# Altium project MAKKI_ISMAIL_ESPS3_CAM.PrjPcb
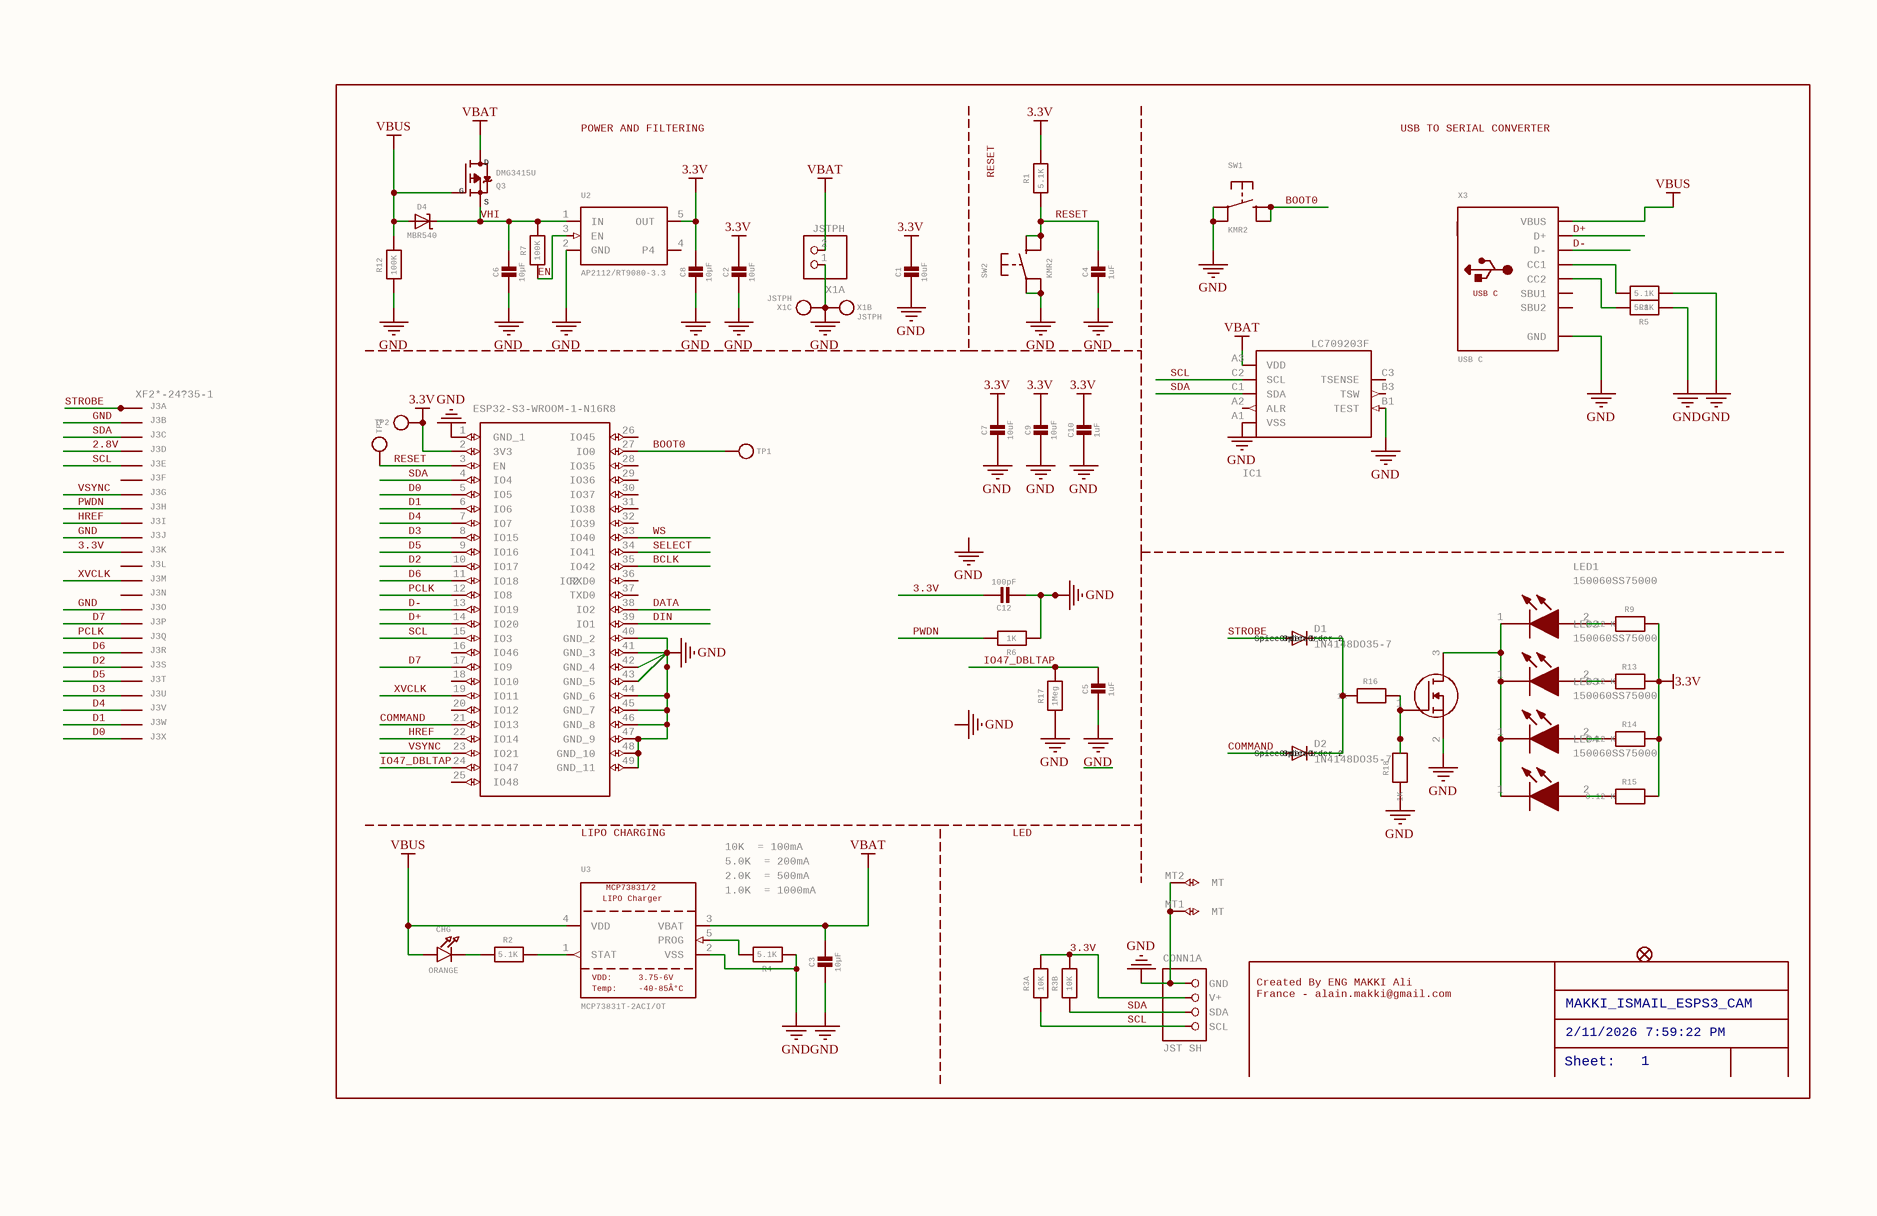
[diagram p0: MAKKI_ISMAIL_ESPS3_CAM_0.SchDoc]
2 sheets, 73 parts. Net scope: global (net labels, ports and power ports of the same name join across sheets).
Board file: MAKKI_ISMAIL_ESPS3_CAM.PcbDoc
Sheets:
  MAKKI_ISMAIL_ESPS3_CAM_0.SchDoc
  MAKKI_ISMAIL_ESPS3_CAM_1.SchDoc

## Sheet MAKKI_ISMAIL_ESPS3_CAM_0.SchDoc: MAKKI_ISMAIL_ESPS3_CAM
size 329 x 212 mm; COMPANY: ADAFRUIT INDUSTRIES; DRAWN: KTOWN; REV: B; Origin: Eagle; OriginPath: C:\Users\aliam\OneDrive\Desktop\MAKKI_ISMAIL_ESPS3_CAM - Copy\MAKKI_ISMAIL_ESPS3_CAM\MAKKI_ISMAIL_ESPS3_CAM.sch; OriginSheet: 1; Date: 2/11/2026 7:59:22 PM; SheetNumber: 1; GateName_1: G$1; SymbolName_1: A4L-LOC; LibraryName: frames; DeviceSetName: A4L-LOC; Sheet: Sheet:

### Parts
C1  10uF  [0805-NO]
C2  10uF  [0805-NO]
C3  10µF  [0805-NO]
C4  1uF  [0603-NO]
C5  1uF  [0603-NO]
C6  10µF  [0805-NO]
C7  10uF  [0805-NO]
C8  10µF  [0805-NO]
C9  10uF  [0805-NO]
C10  1uF  [0603-NO]
C12  100pF  [0805-NO]
CHG  ORANGE  [CHIPLED_0603_NOOUTLINE]
CONN1  JST SH  [JST_SH4_RA]  (parts A,B,C of 3)
D1  1N4148DO35-7  SpiceOrder1: SpiceOrder 1  SpiceOrder2: SpiceOrder 2  [DO35-7]
D2  1N4148DO35-7  SpiceOrder1: SpiceOrder 1  SpiceOrder2: SpiceOrder 2  [DO35-7]
D4  MBR540  [SOD-123]
IC1  LC709203F/MH  [WLCSP9]  (value not drawn)
IC2  ESP32-S3-WROOM-1-N16R8  [ESP32S3WROOM1N16R8]
J3  XF2*-24?35-1  [XF2L-2435-1]  (parts A,B,C,D,E,F,G,H,I,J,K,L,M,N,O,P,Q,R,S,T,U,V,W,X of 24)
LED1  150060SS75000  [LEDC1608X80N]
LED2  150060SS75000  [LEDC1608X80N]
LED3  150060SS75000  [LEDC1608X80N]
LED4  150060SS75000  [LEDC1608X80N]
Q2  2N7002  [SOT96P240X120-3N]  (value not drawn)
Q3  DMG3415U  [SOT23-R]
R1  5.1K  [0603-NO]
R2  5.1K  [0603-NO]
R3  10K  [RESPACK_4X0603]  (parts A,B of 4)
R4  5.1K  [0603-NO]
R5  5.1K  [0603-NO]
R6  1K  [0603-NO]
R7  100K  [0603-NO]
R8  5.1K  [0603-NO]
R9  0.12 K  [0603-NO]
R12  100K  [0603-NO]
R13  0.12 K  [0603-NO]
R14  0.12 K  [0603-NO]
R15  0.12 K  [0603-NO]
R16  1K  [0603-NO]
R17  1Meg  [0603-NO]
R18  1K  [0603-NO]
SW1  KMR2  [BTN_KMR2_4.6X2.8]
SW2  KMR2  [BTN_KMR2_4.6X2.8]
TP1  TESTPOINTROUND1.5MMNO  [TESTPOINT_ROUND_1.5MM_NO]  (value not drawn)
TP2  TESTPOINTROUND1.5MMNO  [TESTPOINT_ROUND_1.5MM_NO]  (value not drawn)
TP3  TESTPOINTROUND1.5MMNO  [TESTPOINT_ROUND_1.5MM_NO]  (value not drawn)
U2  AP2112/RT9080-3.3  [SOT23-5]
U3  MCP73831T-2ACI/OT  LIPOCharger: LIPO Charger  Temp: Temp:  VDD: VDD:  [SOT23-5]
U$34  FIDUCIAL_1MM  [FIDUCIAL_1MM]  (value not drawn)
X1  JSTPH  [JSTPH2_BATT]  (parts A,B,C of 3)
X3  USB C  [USB_C_CUSB31-CFM2AX-01-X]

### Nets
3.3V: C1.1 C2.1 C7.1 C8.1 C9.1 C10.1 C12.1 CONN1.2(V+) IC2.2(3V3) J3.11(MS) R1.2 R3.7 R3.8 R9.2 R13.2 R14.2 R15.2 TP2.P$1 U2.5(OUT)
GND: C1.2 C2.2 C3.2 C4.2 C5.2 C6.2 C7.2 C8.2 C9.2 C10.2 C12.2 CONN1.1(GND) CONN1.MT1(MT) CONN1.MT2(MT) IC1.A1(VSS) IC1.B1(TEST) IC2.1(GND_1) IC2.40(GND_2) IC2.41(GND_3) IC2.42(GND_4) IC2.43(GND_5) IC2.44(GND_6) IC2.45(GND_7) IC2.46(GND_8) IC2.47(GND_9) IC2.48(GND_10) IC2.49(GND_11) J3.2(MS) J3.10(MS) J3.15(MS) Q2.2(S) R4.1 R5.1 R6.1 R8.1 R12.1 R17.1 R18.1 SW1.A(P) SW1.A'(P1) SW2.A(P) SW2.A'(P1) U2.2(GND) U3.2(VSS) X1.1 X1.NC1(P$1) X1.NC2(P$1) X3.A1B12,B1A12(GND)
VBAT: C3.1 IC1.A3(VDD) Q3.3(D) U3.3(VBAT) X1.2
VBUS: CHG.A D4.A Q3.1(G) R12.2 U3.4(VDD) X3.A4B9,B4A9(VBUS)
2.8V: J3.4(MS)
BCLK: IC2.35(IO42)
BOOT0: IC2.27(IO0) SW1.B(S) SW1.B'(S1) TP1.P$1
COMMAND: D2.A IC2.21(IO13)
D0: IC2.5(IO5) J3.24(MS)
D1: IC2.6(IO6) J3.23(MS)
D2: IC2.10(IO17) J3.19(MS)
D3: IC2.8(IO15) J3.21(MS)
D4: IC2.7(IO7) J3.22(MS)
D5: IC2.9(IO16) J3.20(MS)
D6: IC2.11(IO18) J3.18(MS)
D7: IC2.17(IO9) J3.16(MS)
D+: IC2.14(IO20) X3.A6,B6(D+)
D-: IC2.13(IO19) X3.A7,B7(D-)
DATA: IC2.38(IO2)
DIN: IC2.39(IO1)
EN: R7.1 U2.3(EN)
HREF: IC2.22(IO14) J3.9(MS)
IO47_DBLTAP: C5.1 IC2.24(IO47) R17.2
PCLK: IC2.12(IO8) J3.17(MS)
PWDN: J3.8(MS) R6.2
RESET: C4.1 IC2.3(EN) R1.1 SW2.B(S) SW2.B'(S1) TP3.P$1
SCL: CONN1.4(SCL) IC1.C2(SCL) IC2.15(IO3) J3.5(MS) R3.1
SDA: CONN1.3(SDA) IC1.C1(SDA) IC2.4(IO4) J3.3(MS) R3.2
SELECT: IC2.34(IO41)
STROBE: D1.A J3.1(MSV)
VHI: C6.1 D4.C Q3.2(S) R7.2 U2.1(IN)
VSYNC: IC2.23(IO21) J3.7(MS)
WS: IC2.33(IO40)
XVCLK: IC2.19(IO11) J3.13(MS)
NetCHG_C: CHG.C R2.1
NetD1_C: D1.C D2.C R16.1
NetLED1_1: LED1.1(K) LED2.1(K) LED3.1(K) LED4.1(K) Q2.3(D)
NetLED1_2: LED1.2(A) R9.1
NetLED2_2: LED2.2(A) R13.1
NetLED3_2: LED3.2(A) R14.1
NetLED4_2: LED4.2(A) R15.1
NetQ2_1: Q2.1(G) R16.2 R18.2
NetR2_2: R2.2 U3.1(STAT)
NetR4_2: R4.2 U3.5(PROG)
NetR5_2: R5.2 X3.B5(CC2)
NetR8_2: R8.2 X3.A5(CC1)

Not connected (* = marked no-connect by the designer): IC1 A2(ALR) B3(TSW) C3(TSENSE); IC2 16(IO46) 18(IO10) 20(IO12) 25(IO48) 26(IO45) 28(IO35) 29(IO36) 30(IO37) 31(IO38) 32(IO39) 36(RXD0) 37(TXD0); J3 6(MS) 12(MS) 14(MS); U2 4(P4); X3 A8(SBU1) B8(SBU2)

### Notes on the sheet
- POWER AND FILTERING
- USB TO SERIAL CONVERTER
- (near R1) RESET
- (near IC2) LIPO CHARGING
- 10K  = 100mA
- 5.0K  = 200mA
- 2.0K  = 500mA
- LED
- 1.0K  = 1000mA
- Created By ENG MAKKI Ali
  France - alain.makki@gmail.com
- (near U$34) MAKKI_ISMAIL_ESPS3_CAM
- Sheet:
- 2/11/2026 7:59:22 PM
- 1
- Labels drawn without touching a wire or pin: GND

### Library data of the parts
C1-C3 C6-C9 C12 = CAP_CERAMIC0805-NOOUTLINE: Ceramic Capacitors   For new designs, use the packages preceded by an '_' character since they are more reliable:   The following footprints should be used on most boards: _0402 - Standard footprint for regular board layouts  _0603 - Standard footprint for regular board layouts  _0805 - Standard footprint for regular board layouts  _1206 - Standard footprint for regular board layouts       For extremely tight-pitch boards where space is at a premium, the following 'micro-pitch' footprints can be used (smaller pads, no silkscreen outline, etc.): _0402MP - Micro-pitch footprint for very dense/compact boards  _0603MP - Micro-pitch footprint for very dense/compact boards  _0805MP - Micro-pitch footprint for very dense/compact boards  _1206MP - Micro-pitch footprint for very dense/compact boards; GateName_1: G$1; SymbolName_1: CAPACITOR; DeviceName: 0805-NOOUTLINE; LibraryName: microbuilder; DeviceSetName: CAP_CERAMIC
  C8: REV: C
C4 C5 C10 = CAP_CERAMIC0603_NO: Ceramic Capacitors   For new designs, use the packages preceded by an '_' character since they are more reliable:   The following footprints should be used on most boards: _0402 - Standard footprint for regular board layouts  _0603 - Standard footprint for regular board layouts  _0805 - Standard footprint for regular board layouts  _1206 - Standard footprint for regular board layouts       For extremely tight-pitch boards where space is at a premium, the following 'micro-pitch' footprints can be used (smaller pads, no silkscreen outline, etc.): _0402MP - Micro-pitch footprint for very dense/compact boards  _0603MP - Micro-pitch footprint for very dense/compact boards  _0805MP - Micro-pitch footprint for very dense/compact boards  _1206MP - Micro-pitch footprint for very dense/compact boards; GateName_1: G$1; SymbolName_1: CAPACITOR; DeviceName: 0603_NO; LibraryName: microbuilder; DeviceSetName: CAP_CERAMIC
CHG = LED0603_NOOUTLINE: LED0603 - 0603 Surface Mount Package    2mA: Green LED - Low Power (3.9mcd, 2ma, 1.7Vf) - Digikey: 475-2709-2-ND  Orange LED - Low Power (9.8mcd, 2ma, 1.8Vf) - Digikey: 475-1194-2-ND  Red LED - Low Power (5mcd, 2ma, 1.8Vf) - Digikey: 475-1195-2-ND  Yellow LED - Low Power (7mcd, 2ma, 1.8Vf) - Digikey: 475-1196-2-ND       5mA: Blue LED - Low Power (17mcd, 5ma, 2.9Vf) - Digikey: LNJ937W8CRACT-ND    0805 - 0805 Surface Mount Package    2mA: Red LED (8.8mcd, 2mA, 1.8Vf, Clear) - Low Power [Digikey: 475-2510-1-ND]  Green LED (5mcd, 2mA, 1.8Vf, Clear) - Low Power [Digikey: 475-2730-1-ND]  Yellow LED (11.3mcd, 2mA, 1.8Vf, Clear) - Low Power [Digikey: 475-2555-1-ND]       20mA: Red LED (104mcd, 20mA, Diffused) - LS R976 [Digikey: 475-1278-6-ND]  Red LED (12mcd, 20mA, 2.0Vf, Clear) - APT2012EC [Digikey: 754-1128-1-ND]  Green LED (15mcd, 20mA, 2.2Vf, Clear) - APT2012GC [Digikey: 754-1131-1-ND]  Orange LED (160mcd, 20mA, 2.1Vf, Clear) - APT2012SECK [Digikey: 754-1130-1-ND]     1206 - 1206 Surface Mount Package  Green LED (26mcd, 20mA, Diffused) - LG N971  [Digikey: 475-1407-6-ND]  Red LED (15mcd, 20mA, Diffused) - LH N974 [Digikey: 475-1416-6-ND]     Cree - Cree High-Power Surface Mount LEDs  XPEBWT-L1-0000-00D50 - White 111lm 350mA 2.9Vf 6200K 110Â°  XTEAWT-00-0000-00000LEE3 - White 114lm 350mA 2.85Vf 5000K 115Â°     Everlight - Everlight 45-21 Series Surface Mount LEDs  45-21/QK2C-B2832AC2CB2/2T - Warm White 2000mcd 20mA 3.25Vf 3050K 120Â°  45-21/LK2C-B38452C4CB2/2T - Nuetral White 2000mcd 20mA 3.25Vf 4150K 120Â°  45-21/LK2C-B50634C6CB2/2T - Cold White 2200mcd 20mA 3.25Vf 5650K 120Â°     PLCC2 Reverse Mount LS T77K-J1L2-1-0-2-R18-Z - Red 11.25mcd 2mA 1.8Vf 630nm 120Â°  LO T77K-L1M2-24-Z - Orange 19.6mcd 2mA 1.8Vf 606nm 120Â°  LY T77K-K2M1-26-Z - Yellow 15.7mcd 2mA 1.8Vf 587nm 120Â°; GateName_1: G$1; SymbolName_1: LED; DeviceName: 0603_NOOUTLINE; LibraryName: microbuilder; DeviceSetName: LED
CONN1 = STEMMA_I2C_QTRA: GateName_1: G$1; GateName_2: G$2; SymbolName_2: MOUNTING; GateName_3: G$3; DeviceName: _QTRA; SymbolName_1: STEMMA_I2C; SymbolName_3: MOUNTING; LibraryName: microbuilder; DeviceSetName: STEMMA_I2C
D1 D2 = 1N4148DO35-7: DIODE   high speed (Philips); GateName_1: G$1; SymbolName_1: D; DeviceSetName: 1N4148; POPULARITY: 58; DeviceName: DO35-7; LibraryName: diode
D4 = DIODE-SCHOTTKYSOD-123: GateName_1: G$1; SymbolName_1: DIODE-SCHOTTKY; DeviceName: SOD-123; LibraryName: microbuilder; DeviceSetName: DIODE-SCHOTTKY
IC1 = LC709203F/MH: GateName_1: G$1; DeviceName: /MH; SymbolName_1: LC709203F; LibraryName: adafruit_sensor; DeviceSetName: LC709203F; LC709203F: LC709203F
IC2 = ESP32-S3-WROOM-1-N16R8: Multiprotocol Modules SMD Module, ESP32-S3R8, 3.3V, 8 MB Octal PSRAM Die, 16 MB Quad SPI Flash, PCB Antenna   Source:  Datasheet; MANUFACTURER_NAME: Espressif Systems; GateName_1: G$1; SymbolName_1: ESP32-S3-WROOM-1-N16R8; LibraryName: SamacSys_Parts; DeviceSetName: ESP32-S3-WROOM-1-N16R8; HEIGHT: 3.25mm; MANUFACTURER_PART_NUMBER: ESP32-S3-WROOM-1-N16R8; MOUSER_PART_NUMBER: 356-ESP32S3WRM1N16R8; MOUSER_PRICE-STOCK: https://www.mouser.co.uk/ProductDetail/Espressif-Systems/ESP32-S3-WROOM-1-N16R8?qs=Li%252BoUPsLEnvQc9gW6AMhZg%3D%3D
J3 = XF2*-24?35-1: OMRON FPC Connector   Source : http://www.omron.com/ecb/products/pdf/fpc.pdf; MPN: XF2L-2435-1A; GateName_1: -1; SymbolName_1: PV; GateName_2: -2; SymbolName_2: P; GateName_3: -3; GateName_4: -4; GateName_5: -5; GateName_6: -6; GateName_7: -7; GateName_8: -8; GateName_9: -9; GateName_10: -10; GateName_11: -11; GateName_12: -12; GateName_13: -13; GateName_14: -14; GateName_15: -15; GateName_16: -16; GateName_17: -17; GateName_18: -18; GateName_19: -19; GateName_20: -20; GateName_21: -21; GateName_22: -22; GateName_23: -23; GateName_24: -24; DeviceName: 35-1; SymbolName_3: P; SymbolName_4: P; SymbolName_5: P; SymbolName_6: P; SymbolName_7: P; SymbolName_8: P; SymbolName_9: P; SymbolName_10: P; SymbolName_11: P; SymbolName_12: P; SymbolName_13: P; SymbolName_14: P; SymbolName_15: P; SymbolName_16: P; SymbolName_17: P; SymbolName_18: P; SymbolName_19: P; SymbolName_20: P; SymbolName_21: P; SymbolName_22: P; SymbolName_23: P; SymbolName_24: P; LibraryName: con-omron; DeviceSetName: XF2*-24?; MF: MF; OC_FARNELL: unknown; OC_NEWARK: 05M2005
LED1-LED4 = 150060SS75000: WL-SMCW SMT Mono-Color Chip LED Waterclear 0603, Super Red Typ.(@20mA): 630nm, 60mcd, 1.9V, 140 AlInGaP   Source:  Datasheet; MANUFACTURER_NAME: Wurth Elektronik; GateName_1: G$1; SymbolName_1: 150060SS75000; LibraryName: SamacSys_Parts; DeviceSetName: 150060SS75000; HEIGHT: 0.8mm; MANUFACTURER_PART_NUMBER: 150060SS75000; MOUSER_PART_NUMBER: 710-150060SS75000; MOUSER_PRICE-STOCK: https://www.mouser.co.uk/ProductDetail/Wurth-Elektronik/150060SS75000?qs=LlUlMxKIyB0oQaxwspeTEA%3D%3D
Q2 = 2N7002: Voltage controlled small signal switch.; High density cell design for extremely low RDS(ON).; Rugged and Reliable.; High saturation current capability.   Source:  Datasheet; MANUFACTURER_NAME: onsemi; GateName_1: G$1; SymbolName_1: 2N7002; LibraryName: SamacSys_Parts; DeviceSetName: 2N7002; HEIGHT: 1.2mm; MANUFACTURER_PART_NUMBER: 2N7002; MOUSER_PART_NUMBER: 512-2N7002; MOUSER_PRICE-STOCK: https://www.mouser.co.uk/ProductDetail/onsemi-Fairchild/2N7002?qs=0dwsXDNhqlz66WJJhrTFjQ%3D%3D
Q3 = MOSFET-P: P-Channel Mosfet   LEGEND   VDS: Voltage Drain-Source ID: Drain Current RDS(ON): Drain-Source On-State Resistance VGS(TH): Gate-Source Threshold Voltage CISS: Drain-Source Input Capacitance    SOT-23   Name	VDS	ID	RDS(ON)	VGS(TH)	CISS	Order Number	   IRLML5103	30V	760mA	600 mOhm	--	75pF @ 25V	Digikey: IRLML5103PBFCT-ND	   IRLML6401	12V	4.3A	50 mOhm	950mV @ 250ÂµA	830pF @ 10V	Digikey: IRLML6401PBFTR-ND	   NTR0202PL	20V	400mA	800 mOhm	2.3V @ 250uA	70pF @ 5V	Digikey: NTR0202PLT1GOSTR-ND	   NTR4101PT1G	20V	1.8A	85 mOhm	1.2V @ 250uA	675pF @ 10V	Digikey: NTR4101PT1GOSCT-ND	   DMP2004K	20V	600mA	900 mOhm	1V @ 250uA	175pF @ 16V	Digikey: DMP2004KDICT-ND	   PMV65XP	20V	3.9A	76 mOhm	950mV @ 1mA	725pF @ 20V	Digikey: 568-2358-2-ND	   							   							TO-252   Name	VDS	ID	RDS(ON)	VGS(TH)	CISS	Order Number	   AOD417	30V	25A	34 mOhm	3V @ 250ÂµA	920pF @ 15V	Digikey: 785-1106-2-ND	PowerPak   Name	VDS	ID	RDS(ON)	VGS(TH)	CISS	Order Number	   AON7401	30V	12A	14 mOhm	3V @ 250ÂµA	2600pF @ 15V	Digikey: 785-1302-1-ND; GateName_1: G$1; SymbolName_1: MOSFET-P; LibraryName: microbuilder; DeviceSetName: MOSFET-P; D: D; S: S; G: G
R1 R2 R4-R9 R12-R18 = RESISTOR_0603_NOOUT: Resistors   For new designs, use the packages preceded by an '_' character since they are more reliable:   The following footprints should be used on most boards: _0402 - Standard footprint for regular board layouts  _0603 - Standard footprint for regular board layouts  _0805 - Standard footprint for regular board layouts  _1206 - Standard footprint for regular board layouts       For extremely tight-pitch boards where space is at a premium, the following 'micro-pitch' footprints can be used (smaller pads, no silkscreen outline, etc.): _0402MP - Micro-pitch footprint for very dense/compact boards  _0603MP - Micro-pitch footprint for very dense/compact boards  _0805MP - Micro-pitch footprint for very dense/compact boards  _1206MP - Micro-pitch footprint for very dense/compact boards; GateName_1: G$1; SymbolName_1: RESISTOR; DeviceName: _0603_NOOUT; LibraryName: microbuilder; DeviceSetName: RESISTOR
R3 = RESISTOR_4PACK: Resistor Packs (4 resistors)   4 x 0603 10K 1/16W - Digikey: YC164J-10KCT-ND; GateName_1: G$1; GateName_2: G$2; GateName_3: G$3; GateName_4: G$4; SymbolName_1: RESISTOR; SymbolName_2: RESISTOR; SymbolName_3: RESISTOR; SymbolName_4: RESISTOR; LibraryName: microbuilder; DeviceSetName: RESISTOR_4PACK
SW1 SW2 = SWITCH_TACT_SMT4.6X2.8: SMT Tact Switches 6x6mm - Digikey: P12940SCT-ND  KMR2 (4.6x2.8mm) - Digikey: 401-1426-1-ND  EVQ-PQHB55 - Light Touch, 160GF (4.5x4.5mm) - Digikey: P8090SCT-ND  KMT0 - KMT021 NGJ LHS (etc.) IP68/Waterproof - Digikey: CKN10289CT-ND; GateName_1: G$1; SymbolName_1: BUTTON_4PIN; DeviceName: 4.6X2.8; LibraryName: microbuilder; DeviceSetName: SWITCH_TACT_SMT
TP1-TP3 = TESTPOINTROUND1.5MMNO: Test Point   Various test points for characterisation and PCB testing    TESTPOINT_SMT - Compact Surface Mount Test Point [Digikey: 5016KTR-ND]; GateName_1: G$1; SymbolName_1: TESTPOINT; DeviceName: ROUND1.5MMNO; LibraryName: microbuilder; DeviceSetName: TESTPOINT
U2 = VREG_SOT23-5: SOT23-5 Fixed Voltage Regulators      Part	Current Out	V Out	V In	V Dropout	Î¸JA (Â°C/W)	TJ (Â°C)	Digikey Part No.	     ADP121	  150mA	  3.3V	  3.4-5.5V	  0.09V @ 150mA	  --	  --	  ADP121-AUJZ33R7CT-ND	     ADP121	  150mA	  3.0V	  3.1-5.5V	  0.09V @ 150mA	  --	  --	  ADP121-AUJZ30R7CT-ND	     ADP122	  300mA	  3.3V	  3.4-5.5V	  0.085V @ 300mA	  --	  --	  ADP122AUJZ-3.3-R7CT-ND	     ADP1712	  300mA	  3.3V	  3.5-5.5V	  0.17V @ 300mA	  --	  --	  ADP1712AUJZ-3.3-R7TR-ND	     AP7311 (Low Cost)	  150mA	  3.3V	  3.5-6V	  0.15V @ 150mA	  --	  --	  AP7311-33WG-7DICT-ND	     LD39015M18R	  150mA	  1.8V	  1.9V-5.5V	  0.08V @ 100mA	  --	  --	  497-6977-1-ND	     LP2985A-33DBVR	  150mA	  3.3V	  3.3-16V	  0.28V @ 150mA	  206	  150	  296-18479-1-ND	     MCP1824T-3302E/OT	  300mA	  3.3V	  3.5V-6V	  0.2V @ 300mA	  --	  --	  MCP1824T-3302E/OTCT-ND	     MIC5205-2.5YM5 TR	  150mA	  2.5V	  2.7-16V	  0.165V @ 150mA	  --	  --	  576-1257-2-ND	     MIC5205-3.0YM5 TR	  150mA	  3.0V	  3.2V-16V	  0.165V @ 150mA	  --	  --	  576-1258-2-ND	     MIC5205-3.3YM5 TR	  150mA	  3.3V	  3.5V-16V	  0.165V @ 150mA	  --	  --	  576-1259-2-ND	     TPS780330220	  150mA	  3.3V+2.2V	  3.6-5.5V	  250mV Max	  --	  --	  296-23332-1-ND	     TDA3663/N1,135	  100mA	  3.3V	  3.5-45V	  0.18V @ 50mA	  --	  --	  568-5343-1-ND	     	  	  	  	  	  	  	  	     	  	  	  	  	  	  	  	   Max operating temp can be calculated using Î¸JA, TJ (max junction temperature), and power in watts.  Set the "Maximum Ambient Temperature" until it reaches TJ ("Max Junction Temperature"), which is the absolute limit for safe use of the regulator: Heat Sink Temperature Calculator   For example, With 12V source into a 3.3V LP2985 and a 30mA load, we are dissipating (12V-3.3V) * 0.03A = 0.261W.  With a Î¸JA of 206 Â°C/W, a TJ of 150Â°C, and 261mW we can safely use the chip without a heat sink up to 75Â°C (=147.1Â°C Junction Temperature).; GateName_1: G$1; SymbolName_1: VREG_SOT23-5; LibraryName: microbuilder; DeviceSetName: VREG_SOT23-5
U3 = MCP73831/2: MCP73831/2 LIPO Charger    VDD: 3.75 - 6V  Temp -40 - 85Â°C  Programmable Charge Rate: 15-500mA       NOTE: STAT is a tri-state logic output on the MCP73831 and an open-drain output on the MCP73832.   SOT23-5 with 4.2V output and tri-state logic on STAT = MCP73831T-2ACI/OT; GateName_1: G$1; SymbolName_1: MCP73831/2; LibraryName: microbuilder; DeviceSetName: MCP73831/2; MCP73831/2: MCP73831/2; -40-85Â°C: -40-85Â°C; 3.75-6V: 3.75-6V
U$34 = FIDUCIAL_1MM: Fiducial Alignment Points   Various fiducial points for machine vision alignment.; GateName_1: G$1; DeviceName: _1MM; BOM: EXCLUDE; SymbolName_1: FIDUCIAL; LibraryName: microbuilder; DeviceSetName: FIDUCIAL
X1 = CON_JST_PH_2PIN_MT_BATT: GateName_1: G$1; SymbolName_1: PINHD2; GateName_2: MT2; SymbolName_2: TESTPOINT; GateName_3: MT1; DeviceName: _BATT; SymbolName_3: TESTPOINT; LibraryName: adafruit_electromech; DeviceSetName: CON_JST_PH_2PIN_MT
X3 = USB_C: USB Type-C USB 2.0 Connector; GateName_1: G$1; SymbolName_1: USB_C; LibraryName: adafruit_connector; DeviceSetName: USB_C; USBC: USB C

## Sheet MAKKI_ISMAIL_ESPS3_CAM_1.SchDoc
size 282 x 199 mm; COMPANY: ADAFRUIT INDUSTRIES; DRAWN: KTOWN; REV: B; Origin: Eagle; OriginPath: C:\Users\aliam\OneDrive\Desktop\MAKKI_ISMAIL_ESPS3_CAM - Copy\MAKKI_ISMAIL_ESPS3_CAM\MAKKI_ISMAIL_ESPS3_CAM.sch; OriginSheet: 2; GateName_1: G$1; SymbolName_1: FRAME_A4; LibraryName: microbuilder; DeviceSetName: FRAME_A4
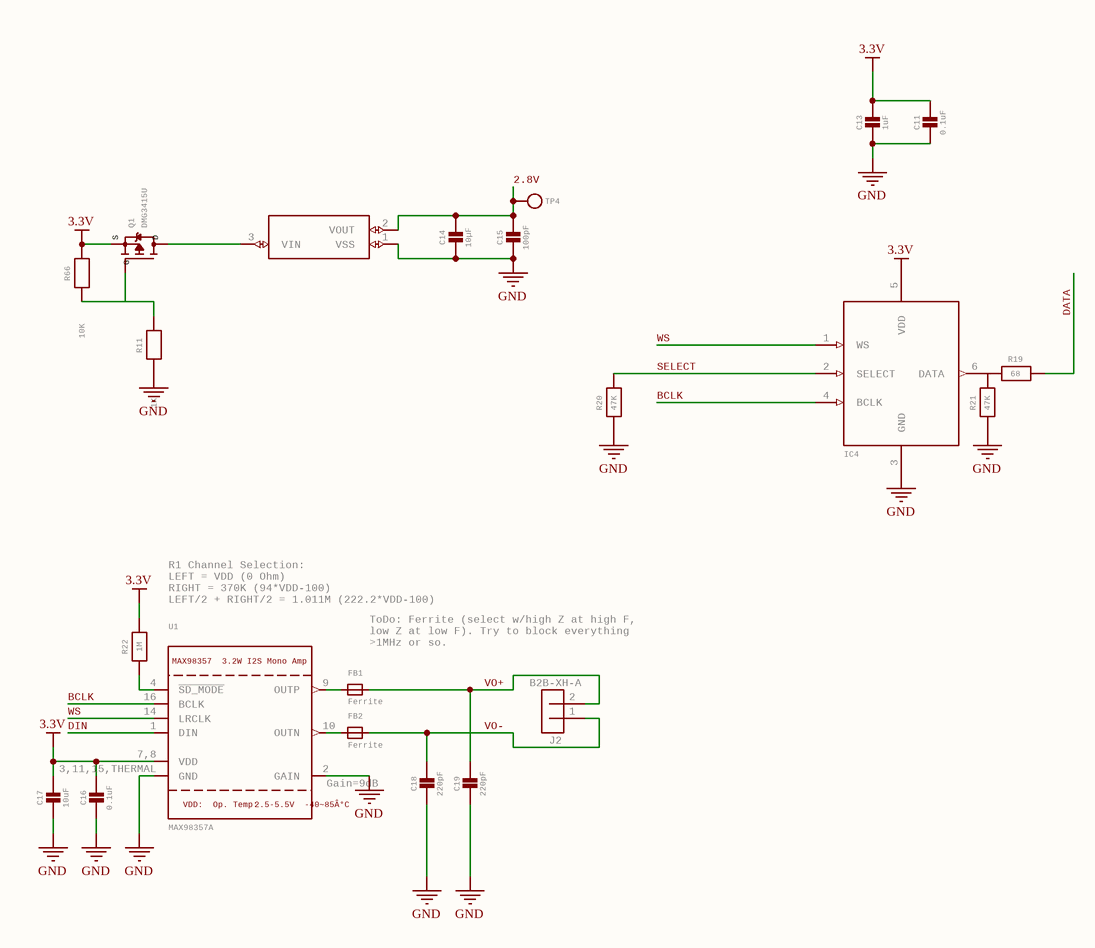
[diagram p1: MAKKI_ISMAIL_ESPS3_CAM_1.SchDoc]

### Parts
C11  0.1uF  [0603-NO]
C13  1uF  [0603-NO]
C14  10µF  [0805-NO]
C15  100pF  [0805-NO]
C16  0.1uF  [0805-NO]
C17  10uF  [0805-NO]
C18  220pF  [0805-NO]
C19  220pF  [0805-NO]
FB1  Ferrite  [0805-NO]
FB2  Ferrite  [0805-NO]
IC3  XC6206P282MR-G  [SOT95P280X130-3N]  (value not drawn)
IC4  ICS-43434  [SPH0645LM4H]  (value not drawn)
J2  B2B-XH-A  [B2B-XH-A]
Q1  DMG3415U  [SOT23-R]
R11  1K  [0603-NO]
R19  68  [0603-NO]
R20  47K  [0603-NO]
R21  47K  [0603-NO]
R22  1M  [0805-NO]
R66  10K  [0603-NO]
TP4  TESTPOINTROUND1.5MMNO  [TESTPOINT_ROUND_1.5MM_NO]  (value not drawn)
U1  MAX98357A  MAX98357
3.2WI2SMonoAmp: MAX98357 / 3.2W I2S Mono Amp  VDD:
Op.Temp: VDD: / Op. Temp:  2.5-5.5V
-40~85Â°C: 2.5-5.5V / -40~85Â°C  [QFN16_3MM]

### Nets
3.3V: C11.1 C13.1 C16.1 C17.1 IC4.5(VDD) Q1.2(S) R22.2 R66.2 U1.7,8(VDD)
GND: C11.2 C13.2 C14.2 C15.2 C16.2 C17.2 C18.2 C19.2 IC3.1(VSS) IC4.3(GND) R11.1 R20.1 R21.1 U1.2(GAIN) U1.3,11,15,THERMAL(GND)
2.8V: C14.1 C15.1 IC3.2(VOUT) TP4.P$1
BCLK: IC4.4(BCLK) U1.16(BCLK)
DATA: R19.2
DIN: U1.1(DIN)
SELECT: IC4.2(SELECT) R20.2
VO+: C19.1 FB1.2(P$2) J2.2
VO-: C18.1 FB2.2(P$2) J2.1
WS: IC4.1(WS) U1.14(LRCLK)
NetFB1_1: FB1.1(P$1) U1.9(OUTP)
NetFB2_1: FB2.1(P$1) U1.10(OUTN)
NetIC3_3: IC3.3(VIN) Q1.3(D)
NetIC4_6: IC4.6(DATA) R19.1 R21.2
NetQ1_1: Q1.1(G) R11.2 R66.1
NetR22_1: R22.1 U1.4(~{SD_MODE})

### Notes on the sheet
- (near R22) R1 Channel Selection:
  LEFT = VDD (0 Ohm)
  RIGHT = 370K (94*VDD-100)
  LEFT/2 + RIGHT/2 = 1.011M (222.2*VDD-100)
- ToDo: Ferrite (select w/high Z at high F,
  low Z at low F). Try to block everything
  >1MHz or so.
- (near U1) Gain=9dB

### Library data of the parts
C11 C13 = CAP_CERAMIC0603_NO: as C4 on sheet MAKKI_ISMAIL_ESPS3_CAM_0; SymbolName_1: CAPACITOR; DeviceName: 0603_NO; LibraryName: microbuilder; DeviceSetName: CAP_CERAMIC
C14-C19 = CAP_CERAMIC0805-NOOUTLINE: as C1 on sheet MAKKI_ISMAIL_ESPS3_CAM_0; SymbolName_1: CAPACITOR; DeviceName: 0805-NOOUTLINE; LibraryName: microbuilder; DeviceSetName: CAP_CERAMIC
FB1 FB2 = FERRITE-0805NO: Ferrite Bead   0603 MMZ1608B121C - 120 Ohm @ 100MHz, 600mA, 0.15 Ohm DC Resistance - Digikey: 445-2164-1-ND  BK1608HW121-T - 120 Ohm, 600mA Ferrite Chip - Digikey: 587-1876-2-ND       0805 HZ0805B272R-10 - 2.7K Ohm @ 100MHz, 200mA, 0.8 Ohm DC Resistance - Digikey: 240-2504-1-ND (see also Murata BLM21BD272SN1L)  MMZ2012Y152B - 1.5K Ohm @ 100MHz, 500mA, 0.4 Ohm DC Resistance - Digikey: 445-1560-1-ND - Mainly for high frequency (80-400MHz)  MMZ2012R102A - 1K Ohm @ 100MHz, 500mA, 0.3 Ohm DC Resistance - Digikey: 445-1555-2-ND - More general purpose (10-200MHz); GateName_1: G$1; SymbolName_1: FERRITE; DeviceName: -0805NO; LibraryName: microbuilder; DeviceSetName: FERRITE
IC3 = XC6206P282MR-G: LDO Voltage Regulators 1uA Low Quiescent 3 Terminal, Low ESR Cap. Compatible, Voltage Regulator   Source:  Datasheet; MANUFACTURER_NAME: Torex; GateName_1: G$1; SymbolName_1: XC6206P282MR-G; LibraryName: SamacSys_Parts; DeviceSetName: XC6206P282MR-G; DESCRIPTION: LDO Voltage Regulators 1uA Low Quiescent 3 Terminal, Low ESR Cap. Compatible, Voltage Regulator; HEIGHT: 1.3mm; MANUFACTURER_PART_NUMBER: XC6206P282MR-G; MOUSER_PART_NUMBER: 865-XC6206P282MR-G; MOUSER_PRICE-STOCK: https://www.mouser.co.uk/ProductDetail/Torex-Semiconductor/XC6206P282MR-G?qs=AsjdqWjXhJ%2Fpd3DOBopSeA%3D%3D
IC4 = MIC_I2S_SPH0645: GateName_1: G$1; SymbolName_1: MIC_I2S; DeviceName: _SPH0645; LibraryName: microbuilder; DeviceSetName: MIC_I2S
J2 = B2B-XH-A: XH Connector Top Entry - 2POS    Reference: : Datasheet; MANUFACTURER: JST Sales America Inc.; PART_STATUS: Active; GateName_1: G$1; SymbolName_1: PINHD2; DESCRIPTION: Connector Header Through Hole 2 position 0.098" (2.50mm); OPERATING_TEMPERATURE: -25°C ~ 85°C; PITCH: 0.098" (2.50mm); LibraryName: Connector; DeviceSetName: B2B-XH-A; CATEGORY: Connectors; DATASHEET: https://www.jst-mfg.com/product/pdf/eng/eXH.pdf; MPN: B2B-XH-A; PACKAGE_SIZE: NA; PACKAGE_TYPE: Through Hole; ROHS: Compliant; SERIES: XH; SUBCATEGORY: Rectangular Connectors; THERMALLOSS: THERMALLOSS; TYPE: Male Headers
Q1 = MOSFET-P: as Q3 on sheet MAKKI_ISMAIL_ESPS3_CAM_0; SymbolName_1: MOSFET-P; LibraryName: microbuilder; DeviceSetName: MOSFET-P; D: D; S: S; G: G
R11 R19-R21 R66 = RESISTOR_0603_NOOUT: as R1 on sheet MAKKI_ISMAIL_ESPS3_CAM_0; SymbolName_1: RESISTOR; DeviceName: _0603_NOOUT; LibraryName: microbuilder; DeviceSetName: RESISTOR
R22 = RESISTOR0805_NOOUTLINE: Resistors   For new designs, use the packages preceded by an '_' character since they are more reliable:   The following footprints should be used on most boards: _0402 - Standard footprint for regular board layouts  _0603 - Standard footprint for regular board layouts  _0805 - Standard footprint for regular board layouts  _1206 - Standard footprint for regular board layouts       For extremely tight-pitch boards where space is at a premium, the following 'micro-pitch' footprints can be used (smaller pads, no silkscreen outline, etc.): _0402MP - Micro-pitch footprint for very dense/compact boards  _0603MP - Micro-pitch footprint for very dense/compact boards  _0805MP - Micro-pitch footprint for very dense/compact boards  _1206MP - Micro-pitch footprint for very dense/compact boards; GateName_1: G$1; SymbolName_1: RESISTOR; DeviceName: 0805_NOOUTLINE; LibraryName: microbuilder; DeviceSetName: RESISTOR
TP4 = TESTPOINTROUND1.5MMNO: as TP1 on sheet MAKKI_ISMAIL_ESPS3_CAM_0; SymbolName_1: TESTPOINT; DeviceName: ROUND1.5MMNO; LibraryName: microbuilder; DeviceSetName: TESTPOINT
U1 = AUDIOAMP_MAX98357: MAX98357 - 3.2W I2S Mono Audio Amp; GateName_1: G$1; SymbolName_1: MAX98357; LibraryName: microbuilder; DeviceSetName: AUDIOAMP_MAX98357

## Nets that join several sheets
3.3V: MAKKI_ISMAIL_ESPS3_CAM_0 (19 pins), MAKKI_ISMAIL_ESPS3_CAM_1 (9 pins)
GND: MAKKI_ISMAIL_ESPS3_CAM_0 (48 pins), MAKKI_ISMAIL_ESPS3_CAM_1 (15 pins)
2.8V: MAKKI_ISMAIL_ESPS3_CAM_0 (J3.4), MAKKI_ISMAIL_ESPS3_CAM_1 (C14.1 C15.1 IC3.2 TP4.P$1)
BCLK: MAKKI_ISMAIL_ESPS3_CAM_0 (IC2.35), MAKKI_ISMAIL_ESPS3_CAM_1 (IC4.4 U1.16)
DATA: MAKKI_ISMAIL_ESPS3_CAM_0 (IC2.38), MAKKI_ISMAIL_ESPS3_CAM_1 (R19.2)
DIN: MAKKI_ISMAIL_ESPS3_CAM_0 (IC2.39), MAKKI_ISMAIL_ESPS3_CAM_1 (U1.1)
SELECT: MAKKI_ISMAIL_ESPS3_CAM_0 (IC2.34), MAKKI_ISMAIL_ESPS3_CAM_1 (IC4.2 R20.2)
WS: MAKKI_ISMAIL_ESPS3_CAM_0 (IC2.33), MAKKI_ISMAIL_ESPS3_CAM_1 (IC4.1 U1.14)